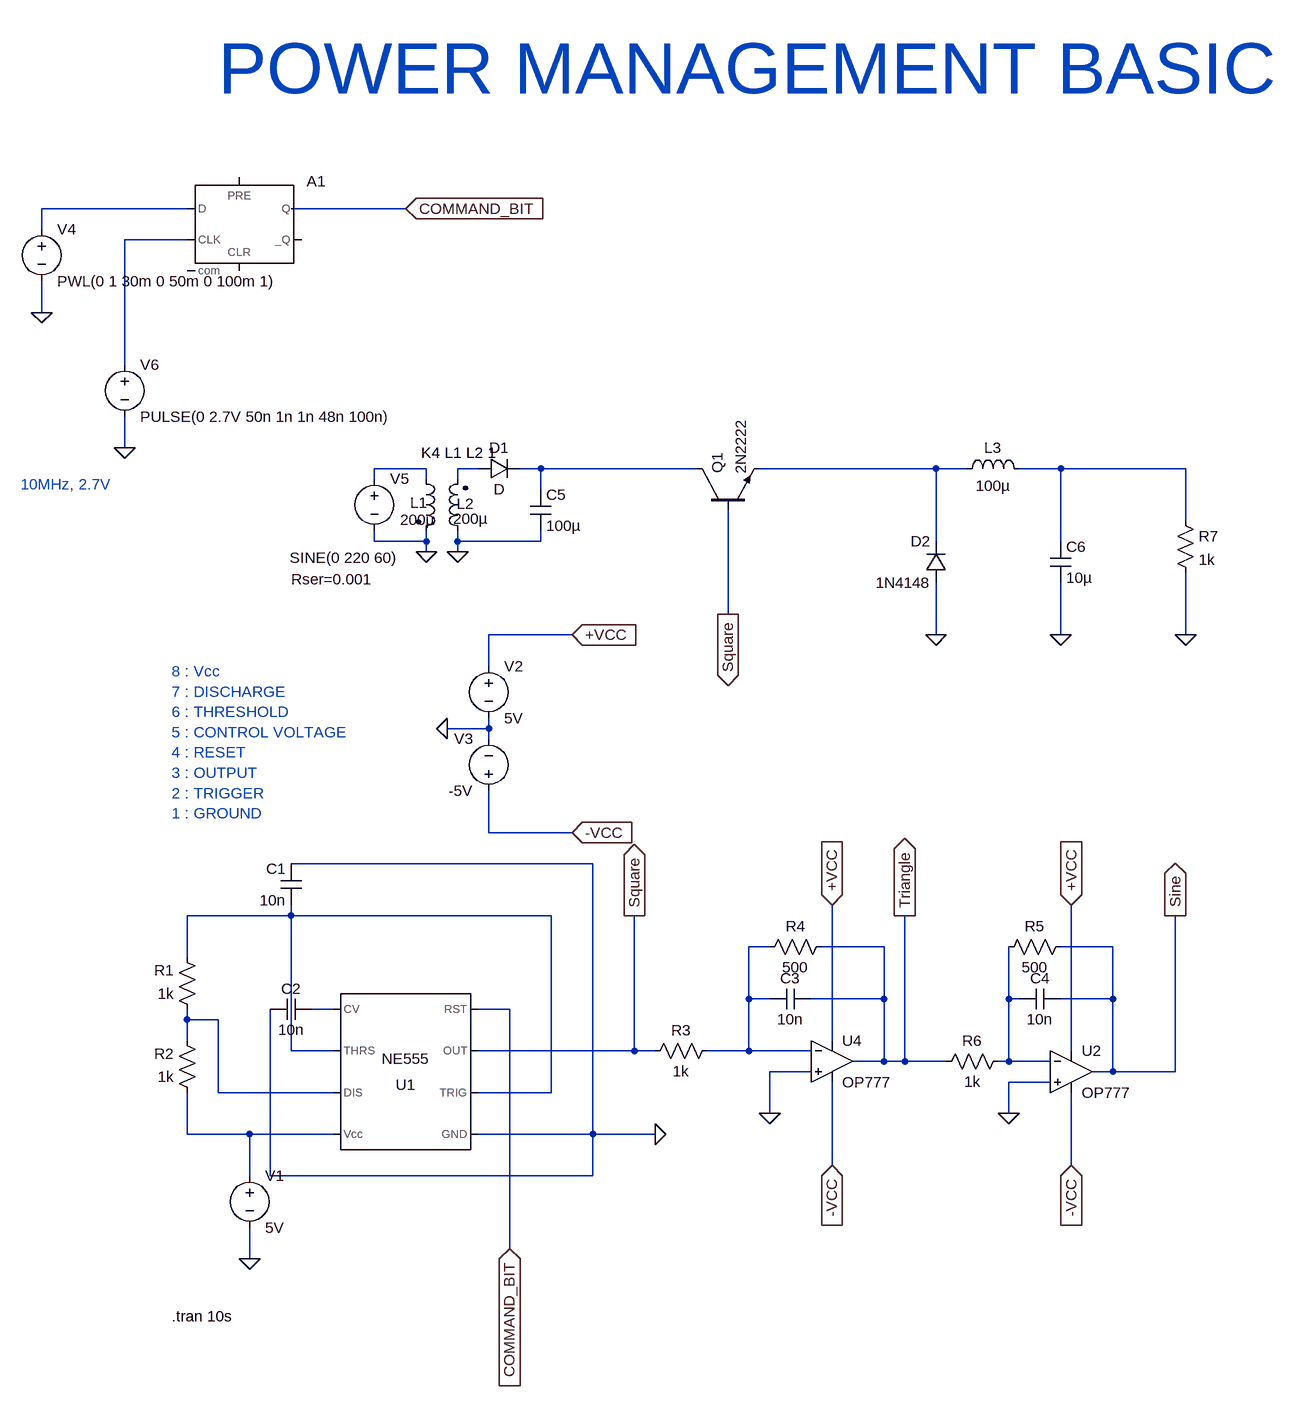
[diagram p0: schematic POWER MANAGEMENT BASIC.asc]
POWER MANAGEMENT BASIC.asc, the LTspice schematic file:
Version 4
SHEET 1 1716 768
WIRE -416 -1072 -640 -1072
WIRE -80 -1072 -256 -1072
WIRE -640 -1040 -640 -1072
WIRE -416 -1024 -512 -1024
WIRE -640 -912 -640 -960
WIRE -512 -832 -512 -1024
WIRE -512 -704 -512 -752
WIRE -48 -672 -128 -672
WIRE 32 -672 0 -672
WIRE 128 -672 96 -672
WIRE 368 -672 128 -672
WIRE 736 -672 464 -672
WIRE 784 -672 736 -672
WIRE 928 -672 864 -672
WIRE 1120 -672 928 -672
WIRE -128 -656 -128 -672
WIRE -48 -656 -48 -672
WIRE 0 -656 0 -672
WIRE 128 -640 128 -672
WIRE 1120 -592 1120 -672
WIRE -128 -560 -128 -576
WIRE -48 -560 -48 -576
WIRE -48 -560 -128 -560
WIRE 0 -560 0 -576
WIRE 128 -560 128 -576
WIRE 128 -560 0 -560
WIRE 736 -560 736 -672
WIRE 928 -560 928 -672
WIRE -48 -544 -48 -560
WIRE 0 -544 0 -560
WIRE 416 -448 416 -608
WIRE 176 -416 48 -416
WIRE 736 -416 736 -496
WIRE 928 -416 928 -496
WIRE 1120 -416 1120 -512
WIRE 48 -368 48 -416
WIRE 48 -272 48 -288
WIRE 48 -272 -16 -272
WIRE 48 -256 48 -272
WIRE 48 -112 48 -176
WIRE 176 -112 48 -112
WIRE 208 -64 -256 -64
WIRE -256 16 -256 0
WIRE -256 16 -416 16
WIRE 144 16 -256 16
WIRE 480 64 448 64
WIRE 656 64 560 64
WIRE 1008 64 928 64
WIRE -416 80 -416 16
WIRE 448 144 448 64
WIRE 480 144 448 144
WIRE 656 144 656 64
WIRE 656 144 544 144
WIRE 848 144 848 64
WIRE 864 144 848 144
WIRE 1008 144 1008 64
WIRE 1008 144 928 144
WIRE -192 160 -224 160
WIRE 80 160 32 160
WIRE -416 176 -416 160
WIRE -368 176 -416 176
WIRE -416 208 -416 176
WIRE 576 208 576 0
WIRE -256 224 -256 16
WIRE -192 224 -256 224
WIRE 272 224 272 16
WIRE 272 224 32 224
WIRE 304 224 272 224
WIRE 448 224 448 144
WIRE 448 224 384 224
WIRE 544 224 448 224
WIRE 944 224 944 0
WIRE 656 240 656 144
WIRE 656 240 608 240
WIRE 688 240 688 16
WIRE 688 240 656 240
WIRE 752 240 688 240
WIRE 848 240 848 144
WIRE 848 240 832 240
WIRE 912 240 848 240
WIRE 544 256 480 256
WIRE 1008 256 1008 144
WIRE 1008 256 976 256
WIRE 1104 256 1104 16
WIRE 1104 256 1008 256
WIRE 912 272 848 272
WIRE -368 288 -368 176
WIRE -192 288 -368 288
WIRE 144 288 144 16
WIRE 144 288 32 288
WIRE 480 320 480 256
WIRE 848 320 848 272
WIRE -416 352 -416 288
WIRE -320 352 -416 352
WIRE -192 352 -320 352
WIRE 208 352 208 -64
WIRE 208 352 32 352
WIRE 304 352 208 352
WIRE 576 400 576 272
WIRE 944 400 944 288
WIRE -320 416 -320 352
WIRE -288 416 -288 160
WIRE 208 416 208 352
WIRE 208 416 -288 416
WIRE 80 528 80 160
WIRE -320 544 -320 496
FLAG -320 544 0
FLAG 304 352 0
FLAG 272 16 Square
IOPIN 272 16 Out
FLAG 176 -416 +VCC
IOPIN 176 -416 In
FLAG 176 -112 -VCC
IOPIN 176 -112 In
FLAG 688 16 Triangle
IOPIN 688 16 Out
FLAG 1104 16 Sine
IOPIN 1104 16 Out
FLAG 848 320 0
FLAG 480 320 0
FLAG -16 -272 0
FLAG 576 0 +VCC
IOPIN 576 0 In
FLAG 576 400 -VCC
IOPIN 576 400 In
FLAG 944 0 +VCC
IOPIN 944 0 In
FLAG 944 400 -VCC
IOPIN 944 400 In
FLAG -640 -912 0
FLAG -48 -544 0
FLAG 0 -544 0
FLAG 736 -416 0
FLAG 928 -416 0
FLAG 1120 -416 0
FLAG 416 -448 Square
IOPIN 416 -448 Out
FLAG -80 -1072 COMMAND_BIT
IOPIN -80 -1072 In
FLAG -512 -704 0
FLAG 80 528 COMMAND_BIT
IOPIN 80 528 In
SYMBOL Misc\\NE555 -80 256 R180
SYMATTR InstName U1
SYMBOL voltage -320 400 R0
SYMATTR InstName V1
SYMATTR Value 5V
SYMBOL res -400 176 R180
WINDOW 0 36 76 Left 2
WINDOW 3 36 40 Left 2
SYMATTR InstName R1
SYMATTR Value 1k
SYMBOL res -400 304 R180
WINDOW 0 36 76 Left 2
WINDOW 3 36 40 Left 2
SYMATTR InstName R2
SYMATTR Value 1k
SYMBOL cap -240 0 R180
WINDOW 0 24 56 Left 2
WINDOW 3 24 8 Left 2
SYMATTR InstName C1
SYMATTR Value 10n
SYMBOL cap -288 176 R270
WINDOW 0 32 32 VTop 2
WINDOW 3 0 32 VBottom 2
SYMATTR InstName C2
SYMATTR Value 10n
SYMBOL res 400 208 R90
WINDOW 0 0 56 VBottom 2
WINDOW 3 32 56 VTop 2
SYMATTR InstName R3
SYMATTR Value 1k
SYMBOL voltage 48 -384 R0
SYMATTR InstName V2
SYMATTR Value 5V
SYMBOL cap 544 128 R90
WINDOW 0 0 32 VBottom 2
WINDOW 3 32 32 VTop 2
SYMATTR InstName C3
SYMATTR Value 10n
SYMBOL res 576 48 R90
WINDOW 0 0 56 VBottom 2
WINDOW 3 32 56 VTop 2
SYMATTR InstName R4
SYMATTR Value 500
SYMBOL cap 928 128 R90
WINDOW 0 0 32 VBottom 2
WINDOW 3 32 32 VTop 2
SYMATTR InstName C4
SYMATTR Value 10n
SYMBOL res 944 48 R90
WINDOW 0 0 56 VBottom 2
WINDOW 3 32 56 VTop 2
SYMATTR InstName R5
SYMATTR Value 500
SYMBOL res 848 224 R90
WINDOW 0 0 56 VBottom 2
WINDOW 3 32 56 VTop 2
SYMATTR InstName R6
SYMATTR Value 1k
SYMBOL OpAmps\\OP777 576 176 R0
SYMATTR InstName U4
SYMBOL OpAmps\\OP777 944 192 R0
SYMATTR InstName U2
SYMBOL voltage 48 -160 R180
WINDOW 0 24 96 Left 2
WINDOW 3 24 16 Left 2
SYMATTR InstName V3
SYMATTR Value -5V
SYMBOL voltage -640 -1056 R0
WINDOW 123 0 0 Left 0
WINDOW 39 0 0 Left 0
SYMATTR InstName V4
SYMATTR Value PWL(0 1 30m 0 50m 0 100m 1)
SYMBOL voltage -128 -672 R0
WINDOW 3 -130 137 Left 2
WINDOW 123 0 0 Left 0
WINDOW 39 -128 170 Left 2
SYMATTR Value SINE(0 220 60)
SYMATTR SpiceLine Rser=0.001
SYMATTR InstName V5
SYMBOL ind2 -64 -672 R0
WINDOW 0 -9 53 Left 2
WINDOW 3 -24 79 Left 2
SYMATTR InstName L1
SYMATTR Value 200µ
SYMBOL ind2 16 -560 R180
WINDOW 0 -10 58 Left 2
WINDOW 3 -31 35 Left 2
SYMATTR InstName L2
SYMATTR Value 200µ
SYMBOL diode 32 -656 R270
WINDOW 0 32 32 VTop 2
WINDOW 3 0 32 VBottom 2
SYMATTR InstName D1
SYMBOL cap 112 -640 R0
SYMATTR InstName C5
SYMATTR Value 100µ
SYMBOL npn 368 -608 R270
SYMATTR InstName Q1
SYMATTR Value 2N2222
SYMBOL diode 752 -496 R180
WINDOW 0 24 64 Left 2
WINDOW 3 24 0 Left 2
SYMATTR InstName D2
SYMATTR Value 1N4148
SYMBOL cap 912 -560 R0
SYMATTR InstName C6
SYMATTR Value 10µ
SYMBOL ind 768 -656 R270
WINDOW 0 32 56 VTop 2
WINDOW 3 5 56 VBottom 2
SYMATTR InstName L3
SYMATTR Value 100µ
SYMBOL res 1104 -608 R0
SYMATTR InstName R7
SYMATTR Value 1k
SYMBOL Digital\\dflop -336 -1120 R0
SYMATTR InstName A1
SYMBOL voltage -512 -848 R0
WINDOW 123 0 0 Left 0
WINDOW 39 0 0 Left 0
SYMATTR InstName V6
SYMATTR Value PULSE(0 2.7V 50n 1n 1n 48n 100n)
TEXT -440 -360 Left 2 ;8 : Vcc\n7 : DISCHARGE\n6 : THRESHOLD\n5 : CONTROL VOLTAGE\n4 : RESET\n3 : OUTPUT\n2 : TRIGGER\n1 : GROUND
TEXT -440 632 Left 2 !.tran 10s
TEXT -56 -696 Left 2 !K4 L1 L2 1
TEXT -672 -648 Left 2 ;10MHz, 2.7V
TEXT -368 -1288 Left 7 ;POWER MANAGEMENT BASIC

The netlist it stands for:
* POWER MANAGEMENT BASIC.asc
XU1 0 N008 Square COMMAND_BIT N011 N008 N012 N013 NE555  ; pins GND TRIG OUT RST CV THRS DIS Vcc
V1 N013 0 5V
R1 N012 N008 1k
R2 N013 N012 1k
C1 N008 0 10n
C2 0 N011 10n
R3 N009 Square 1k
V2 +VCC 0 5V
C3 Triangle N009 10n
R4 Triangle N009 500
C4 Sine N010 10n
R5 Sine N010 500
R6 N010 Triangle 1k
XU4 0 N009 +VCC -VCC Triangle OP777  ; pins In+ In- V+ V- OUT
XU2 0 N010 +VCC -VCC Sine OP777  ; pins In+ In- V+ V- OUT
V3 -VCC 0 -5V
V4 N001 0 PWL(0 1 30m 0 50m 0 100m 1)
V5 N003 0 SINE(0 220 60) Rser=0.001
L1 N003 0 200µ
L2 0 N004 200µ
D1 N004 N005 D
C5 N005 0 100µ
Q1 N005 Square N006 0 2N2222
D2 0 N006 1N4148
C6 N007 0 10µ
L3 N006 N007 100µ
R7 N007 0 1k
A1 N001 0 N002 0 0 0 COMMAND_BIT 0 DFLOP
V6 N002 0 PULSE(0 2.7V 50n 1n 1n 48n 100n)
.model D D
.lib standard.dio
.model NPN NPN
.model PNP PNP
.lib standard.bjt
* 8 : Vcc
* 7 : DISCHARGE
* 6 : THRESHOLD
* 5 : CONTROL VOLTAGE
* 4 : RESET
* 3 : OUTPUT
* 2 : TRIGGER
* 1 : GROUND
.tran 10s
K4 L1 L2 1
* 10MHz, 2.7V
* POWER MANAGEMENT BASIC
.lib NE555.sub
.lib ADI.lib
.backanno
.end